# EAGLE schematic ecg (EAGLE 6.5.0)
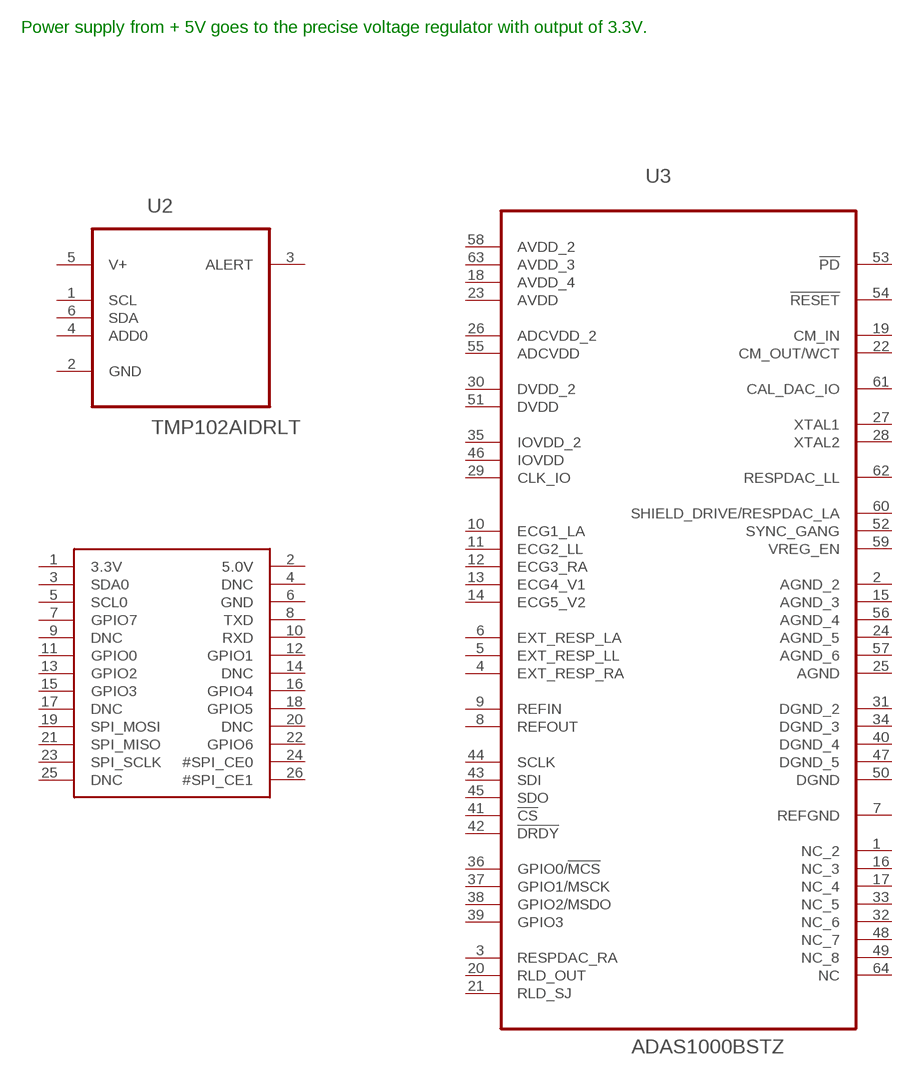
[diagram p0: schematic, sheet 1]

## Parts
U2  TMP102AIDRLT  [SOT50P160X60-6N]
U3  ADAS1000BSTZ  [QFP50P1200X1200X160-64N]
U$1  RASPBERRYPI_BB  [RASBERRYPI_SHIELD]
Unconnected: U2.1(SCL) U2.2(GND) U2.3(ALERT) U2.4(ADD0) U2.6(SDA) U3.1(NC_2) U3.3(RESPDAC_RA) U3.4(EXT_RESP_RA) U3.5(EXT_RESP_LL) U3.6(EXT_RESP_LA) U3.7(REFGND) U3.8(REFOUT) U3.9(REFIN) U3.10(ECG1_LA) U3.11(ECG2_LL) U3.12(ECG3_RA) U3.13(ECG4_V1) U3.14(ECG5_V2) U3.16(NC_3) U3.17(NC_4) U3.19(CM_IN) U3.20(RLD_OUT) U3.21(RLD_SJ) U3.22(CM_OUT/WCT) U3.27(XTAL1) U3.28(XTAL2) U3.29(CLK_IO) U3.30(DVDD_2) U3.31(DGND_2) U3.32(NC_6) U3.33(NC_5) U3.34(DGND_3) U3.36(GPIO0/!MCS) U3.37(GPIO1/MSCK) U3.38(GPIO2/MSDO) U3.39(GPIO3) U3.40(DGND_4) U3.41(!CS) U3.42(!DRDY) U3.43(SDI) U3.44(SCLK) U3.45(SDO) U3.47(DGND_5) U3.48(NC_7) U3.49(NC_8) U3.50(DGND) U3.51(DVDD) U3.52(SYNC_GANG) U3.53(!PD) U3.54(!RESET) U3.59(VREG_EN) U3.60(SHIELD_DRIVE/RESPDAC_LA) U3.61(CAL_DAC_IO) U3.62(RESPDAC_LL) U3.64(NC) U$1.1(3.3V) U$1.2(5.0V) U$1.3(SDA0) U$1.4(DNC) U$1.5(SCL0) U$1.6(GND) U$1.7(GPIO7) U$1.8(TXD) U$1.9(DNC) U$1.10(RXD) U$1.11(GPIO0) U$1.12(GPIO1) U$1.13(GPIO2) U$1.14(DNC) U$1.15(GPIO3) U$1.16(GPIO4) U$1.17(DNC) U$1.18(GPIO5) U$1.19(SPI_MOSI) U$1.20(DNC) U$1.21(SPI_MISO) U$1.22(GPIO6) U$1.23(SPI_SCLK) U$1.24(#SPI_CE0) U$1.25(DNC) U$1.26(#SPI_CE1)

## Notes on the sheet
- Power supply from + 5V goes to the precise voltage regulator with output of 3.3V.

## Power pins joined to a net without a drawn wire
ADCVDD: U3.55(ADCVDD)
ADCVDD_2: U3.26(ADCVDD_2)
AGND: U3.25(AGND)
AGND_2: U3.2(AGND_2)
AGND_3: U3.15(AGND_3)
AGND_4: U3.56(AGND_4)
AGND_5: U3.24(AGND_5)
AGND_6: U3.57(AGND_6)
AVDD: U3.23(AVDD)
AVDD_2: U3.58(AVDD_2)
AVDD_3: U3.63(AVDD_3)
AVDD_4: U3.18(AVDD_4)
IOVDD: U3.46(IOVDD)
IOVDD_2: U3.35(IOVDD_2)
V+: U2.5(V+)

## Library data of the parts
U2 = TMP102:TMP102AIDRLT: Temperature Sensor; MPN: TMP102AIDRLT; OC_FARNELL: 1652477; OC_NEWARK: 53M3987; PACKAGE: SOT-23-6; SUPPLIER: Texas Instruments
U3 = ADAS1000BSTZ:ADAS1000BSTZ: 5 ECG, PACE, RESPIRATION, AFE, 64LQFP; MPN: ADAS1000BSTZ; OC_FARNELL: 2213574; OC_NEWARK: 43W5448; PACKAGE: 64LQFP; SUPPLIER: ANALOG DEVICES
U$1 = microbuilder:RASPBERRYPI_B